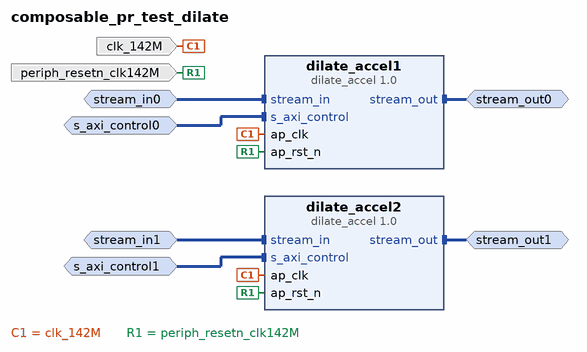
[diagram p0: block diagram of the top level]
# Vivado block design composable_pr_test_dilate, xc7z020clg400-1, Vivado 2020.2.2
create_bd_design composable_pr_test_dilate

create_bd_intf_port -mode Slave -vlnv xilinx.com:interface:aximm_rtl:1.0 s_axi_control0
set_property -dict [list \
  CONFIG.ADDR_WIDTH 31 \
  CONFIG.ARUSER_WIDTH 0 \
  CONFIG.AWUSER_WIDTH 0 \
  CONFIG.BUSER_WIDTH 0 \
  CONFIG.DATA_WIDTH 32 \
  CONFIG.FREQ_HZ 142857132 \
  CONFIG.HAS_BRESP 1 \
  CONFIG.HAS_BURST 0 \
  CONFIG.HAS_CACHE 0 \
  CONFIG.HAS_LOCK 0 \
  CONFIG.HAS_PROT 0 \
  CONFIG.HAS_QOS 0 \
  CONFIG.HAS_REGION 0 \
  CONFIG.HAS_RRESP 1 \
  CONFIG.HAS_WSTRB 1 \
  CONFIG.ID_WIDTH 0 \
  CONFIG.MAX_BURST_LENGTH 1 \
  CONFIG.NUM_READ_OUTSTANDING 1 \
  CONFIG.NUM_READ_THREADS 1 \
  CONFIG.NUM_WRITE_OUTSTANDING 1 \
  CONFIG.NUM_WRITE_THREADS 1 \
  CONFIG.PROTOCOL AXI4LITE \
  CONFIG.READ_WRITE_MODE READ_WRITE \
  CONFIG.RUSER_BITS_PER_BYTE 0 \
  CONFIG.RUSER_WIDTH 0 \
  CONFIG.SUPPORTS_NARROW_BURST 0 \
  CONFIG.WUSER_BITS_PER_BYTE 0 \
  CONFIG.WUSER_WIDTH 0 \
] [get_bd_intf_ports s_axi_control0]
create_bd_intf_port -mode Slave -vlnv xilinx.com:interface:aximm_rtl:1.0 s_axi_control1
set_property -dict [list \
  CONFIG.ADDR_WIDTH 31 \
  CONFIG.ARUSER_WIDTH 0 \
  CONFIG.AWUSER_WIDTH 0 \
  CONFIG.BUSER_WIDTH 0 \
  CONFIG.DATA_WIDTH 32 \
  CONFIG.FREQ_HZ 142857132 \
  CONFIG.HAS_BRESP 1 \
  CONFIG.HAS_BURST 0 \
  CONFIG.HAS_CACHE 0 \
  CONFIG.HAS_LOCK 0 \
  CONFIG.HAS_PROT 0 \
  CONFIG.HAS_QOS 0 \
  CONFIG.HAS_REGION 0 \
  CONFIG.HAS_RRESP 1 \
  CONFIG.HAS_WSTRB 1 \
  CONFIG.ID_WIDTH 0 \
  CONFIG.MAX_BURST_LENGTH 1 \
  CONFIG.NUM_READ_OUTSTANDING 1 \
  CONFIG.NUM_READ_THREADS 1 \
  CONFIG.NUM_WRITE_OUTSTANDING 1 \
  CONFIG.NUM_WRITE_THREADS 1 \
  CONFIG.PROTOCOL AXI4LITE \
  CONFIG.READ_WRITE_MODE READ_WRITE \
  CONFIG.RUSER_BITS_PER_BYTE 0 \
  CONFIG.RUSER_WIDTH 0 \
  CONFIG.SUPPORTS_NARROW_BURST 0 \
  CONFIG.WUSER_BITS_PER_BYTE 0 \
  CONFIG.WUSER_WIDTH 0 \
] [get_bd_intf_ports s_axi_control1]
create_bd_intf_port -mode Slave -vlnv xilinx.com:interface:axis_rtl:1.0 stream_in0
set_property -dict [list \
  CONFIG.FREQ_HZ 142857132 \
  CONFIG.HAS_TKEEP 1 \
  CONFIG.HAS_TLAST 1 \
  CONFIG.HAS_TREADY 1 \
  CONFIG.HAS_TSTRB 1 \
  CONFIG.LAYERED_METADATA undef \
  CONFIG.TDATA_NUM_BYTES 3 \
  CONFIG.TDEST_WIDTH 1 \
  CONFIG.TID_WIDTH 1 \
  CONFIG.TUSER_WIDTH 1 \
] [get_bd_intf_ports stream_in0]
create_bd_intf_port -mode Slave -vlnv xilinx.com:interface:axis_rtl:1.0 stream_in1
set_property -dict [list \
  CONFIG.FREQ_HZ 142857132 \
  CONFIG.HAS_TKEEP 1 \
  CONFIG.HAS_TLAST 1 \
  CONFIG.HAS_TREADY 1 \
  CONFIG.HAS_TSTRB 1 \
  CONFIG.LAYERED_METADATA undef \
  CONFIG.TDATA_NUM_BYTES 3 \
  CONFIG.TDEST_WIDTH 1 \
  CONFIG.TID_WIDTH 1 \
  CONFIG.TUSER_WIDTH 1 \
] [get_bd_intf_ports stream_in1]
create_bd_intf_port -mode Master -vlnv xilinx.com:interface:axis_rtl:1.0 stream_out0
set_property -dict {CONFIG.FREQ_HZ 142857132} [get_bd_intf_ports stream_out0]
create_bd_intf_port -mode Master -vlnv xilinx.com:interface:axis_rtl:1.0 stream_out1
set_property -dict {CONFIG.FREQ_HZ 142857132} [get_bd_intf_ports stream_out1]
create_bd_port -dir I -type clk clk_142M
set_property -dict [list \
  CONFIG.ASSOCIATED_BUSIF s_axi_control0:s_axi_control1:stream_in0:stream_in1:stream_out0:stream_out1 \
  CONFIG.FREQ_HZ 142857132 \
] [get_bd_ports clk_142M]
create_bd_port -dir I -type rst periph_resetn_clk142M

create_bd_cell -type ip -vlnv xilinx.com:hls:dilate_accel:1.0 dilate_accel2
create_bd_cell -type ip -vlnv xilinx.com:hls:dilate_accel:1.0 dilate_accel1

# ---- connections ----

connect_bd_intf_net -intf_net stream_in0_1 [get_bd_intf_ports stream_in0] [get_bd_intf_pins dilate_accel1/stream_in]
connect_bd_intf_net -intf_net stream_in1_1 [get_bd_intf_ports stream_in1] [get_bd_intf_pins dilate_accel2/stream_in]
connect_bd_intf_net [get_bd_intf_ports stream_out0] [get_bd_intf_pins dilate_accel1/stream_out]
connect_bd_intf_net -intf_net s_axi_control0_1 [get_bd_intf_ports s_axi_control0] [get_bd_intf_pins dilate_accel1/s_axi_control]
connect_bd_intf_net -intf_net erode_accel_stream_out [get_bd_intf_ports stream_out1] [get_bd_intf_pins dilate_accel2/stream_out]
connect_bd_intf_net -intf_net s_axi_control1_1 [get_bd_intf_ports s_axi_control1] [get_bd_intf_pins dilate_accel2/s_axi_control]
connect_bd_net [get_bd_ports clk_142M] [get_bd_pins dilate_accel2/ap_clk] [get_bd_pins dilate_accel1/ap_clk]
connect_bd_net [get_bd_ports periph_resetn_clk142M] [get_bd_pins dilate_accel2/ap_rst_n] [get_bd_pins dilate_accel1/ap_rst_n]

# ---- address map ----
assign_bd_address -offset 0x00000000 -range 64K -target_address_space [get_bd_addr_spaces s_axi_control0] [get_bd_addr_segs dilate_accel1/s_axi_control/Reg]
assign_bd_address -offset 0x00000000 -range 32K -target_address_space [get_bd_addr_spaces s_axi_control1] [get_bd_addr_segs dilate_accel2/s_axi_control/Reg]

validate_bd_design
save_bd_design
